# EAGLE design ReadyUNO_SMD (EAGLE 7.5.0)
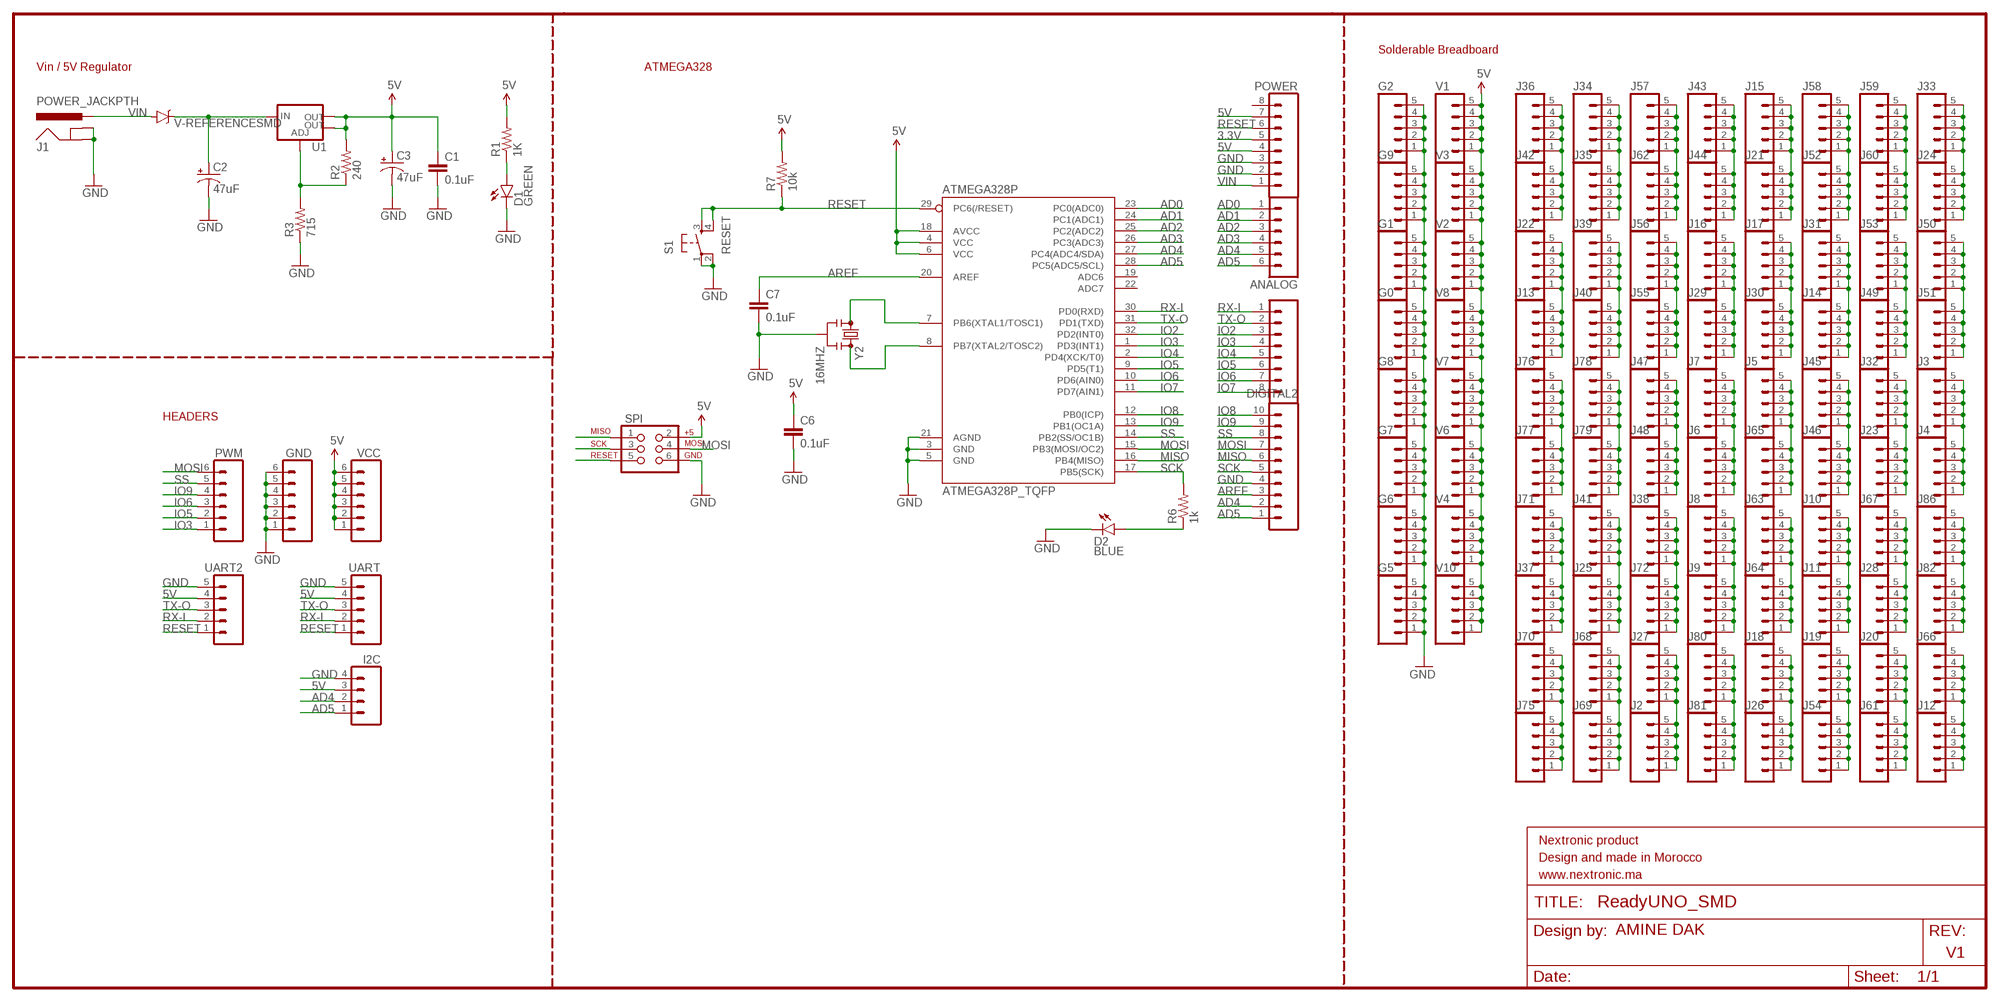
[diagram p0: schematic, sheet 1]

## Parts
ANALOG  M06SILK_FEMALE_PTH  [1X06]
ATMEGA328P  ATMEGA328P_TQFP  [TQFP32-08]
C1  0.1uF  CAP0603-CAP  [0603-CAP]
C2  47uF  CAP_POLC  [PANASONIC_C]
C3  47uF  CAP_POLC  [PANASONIC_C]
C6  0.1uF  CAP0603-CAP  [0603-CAP]
C7  0.1uF  CAP0603-CAP  [0603-CAP]
D1  GREEN  LED-GREEN1206  [LED-1206]
D2  BLUE  LED-BLUE1206  [LED-1206]
DIGITAL  M08SILK_FEMALE_PTH  [1X08]
DIGITAL2  M10SILK_FEMALE_PTH  [1X10]
FRAME1  FRAME-LETTER  [CREATIVE_COMMONS]
G0  M05PTH  [1X05]
G1  M05PTH  [1X05]
G2  M05PTH  [1X05]
G5  M05PTH  [1X05]
G6  M05PTH  [1X05]
G7  M05PTH  [1X05]
G8  M05PTH  [1X05]
G9  M05PTH  [1X05]
GND  M06SILK_FEMALE_PTH  [1X06]
I2C  M04PTH  [1X04]
J1  POWER_JACKPTH  [POWER_JACK_PTH]
J2  M05PTH  [1X05]
J3  M05PTH  [1X05]
J4  M05PTH  [1X05]
J5  M05PTH  [1X05]
J6  M05PTH  [1X05]
J7  M05PTH  [1X05]
J8  M05PTH  [1X05]
J9  M05PTH  [1X05]
J10  M05PTH  [1X05]
J11  M05PTH  [1X05]
J12  M05PTH  [1X05]
J13  M05PTH  [1X05]
J14  M05PTH  [1X05]
J15  M05PTH  [1X05]
J16  M05PTH  [1X05]
J17  M05PTH  [1X05]
J18  M05PTH  [1X05]
J19  M05PTH  [1X05]
J20  M05PTH  [1X05]
J21  M05PTH  [1X05]
J22  M05PTH  [1X05]
J23  M05PTH  [1X05]
J24  M05PTH  [1X05]
J25  M05PTH  [1X05]
J26  M05PTH  [1X05]
J27  M05PTH  [1X05]
J28  M05PTH  [1X05]
J29  M05PTH  [1X05]
J30  M05PTH  [1X05]
J31  M05PTH  [1X05]
J32  M05PTH  [1X05]
J33  M05PTH  [1X05]
J34  M05PTH  [1X05]
J35  M05PTH  [1X05]
J36  M05PTH  [1X05]
J37  M05PTH  [1X05]
J38  M05PTH  [1X05]
J39  M05PTH  [1X05]
J40  M05PTH  [1X05]
J41  M05PTH  [1X05]
J42  M05PTH  [1X05]
J43  M05PTH  [1X05]
J44  M05PTH  [1X05]
J45  M05PTH  [1X05]
J46  M05PTH  [1X05]
J47  M05PTH  [1X05]
J48  M05PTH  [1X05]
J49  M05PTH  [1X05]
J50  M05PTH  [1X05]
J51  M05PTH  [1X05]
J52  M05PTH  [1X05]
J53  M05PTH  [1X05]
J54  M05PTH  [1X05]
J55  M05PTH  [1X05]
J56  M05PTH  [1X05]
J57  M05PTH  [1X05]
J58  M05PTH  [1X05]
J59  M05PTH  [1X05]
J60  M05PTH  [1X05]
J61  M05PTH  [1X05]
J62  M05PTH  [1X05]
J63  M05PTH  [1X05]
J64  M05PTH  [1X05]
J65  M05PTH  [1X05]
J66  M05PTH  [1X05]
J67  M05PTH  [1X05]
J68  M05PTH  [1X05]
J69  M05PTH  [1X05]
J70  M05PTH  [1X05]
J71  M05PTH  [1X05]
J72  M05PTH  [1X05]
J75  M05PTH  [1X05]
J76  M05PTH  [1X05]
J77  M05PTH  [1X05]
J78  M05PTH  [1X05]
J79  M05PTH  [1X05]
J80  M05PTH  [1X05]
J81  M05PTH  [1X05]
J82  M05PTH  [1X05]
J86  M05PTH  [1X05]
POWER  M08SILK_FEMALE_PTH  [1X08]
PWM  M06SILK_FEMALE_PTH  [1X06]
R1  1K  RESISTOR0603-RES  [0603-RES]
R2  240  RESISTOR0603-RES  [0603-RES]
R3  715  RESISTOR0603-RES  [0603-RES]
R6  1k  RESISTOR0603-RES  [0603-RES]
R7  10k  RESISTOR0603-RES  [0603-RES]
S1  RESET  TAC_SWITCHSMD  [TACTILE-SWITCH-SMD]
SPI  AVR_SPI_PRG_6NS  [2X3-NS]
U1  V_REG_LM1117SOT223  [SOT223]
U$1  V-REFERENCESMD  [SOT23-3]
UART  M05PTH  [1X05]
UART2  M05PTH  [1X05]
V1  M05PTH  [1X05]
V2  M05PTH  [1X05]
V3  M05PTH  [1X05]
V4  M05PTH  [1X05]
V6  M05PTH  [1X05]
V7  M05PTH  [1X05]
V8  M05PTH  [1X05]
V10  M05PTH  [1X05]
VCC  M06SILK_FEMALE_PTH  [1X06]
Y2  16MHZ  RESONATOR16MHZ  [RESONATOR-SMD]

## Nets
3.3V: POWER.5
5V: ATMEGA328P.4(VCC) ATMEGA328P.6(VCC) ATMEGA328P.18(AVCC) C1.1 C3.+ C6.1 I2C.3 POWER.4 POWER.7 R1.2 R2.2 R7.2 SPI.2 U1.2(OUT) U1.4(OUT) UART2.4 UART.4 V1.1 V1.2 V1.3 V1.4 V1.5 V2.1 V2.2 V2.3 V2.4 V2.5 V3.1 V3.2 V3.3 V3.4 V3.5 V4.1 V4.2 V4.3 V4.4 V4.5 V6.1 V6.2 V6.3 V6.4 V6.5 V7.1 V7.2 V7.3 V7.4 V7.5 V8.1 V8.2 V8.3 V8.4 V8.5 V10.1 V10.2 V10.3 V10.4 V10.5 VCC.1 VCC.2 VCC.3 VCC.4 VCC.5 VCC.6
AD0: ANALOG.1 ATMEGA328P.23(PC0(ADC0))
AD1: ANALOG.2 ATMEGA328P.24(PC1(ADC1))
AD2: ANALOG.3 ATMEGA328P.25(PC2(ADC2))
AD3: ANALOG.4 ATMEGA328P.26(PC3(ADC3))
AD4: ANALOG.5 ATMEGA328P.27(PC4(ADC4/SDA)) DIGITAL2.2 I2C.2
AD5: ANALOG.6 ATMEGA328P.28(PC5(ADC5/SCL)) DIGITAL2.1 I2C.1
AREF: ATMEGA328P.20(AREF) C7.1 DIGITAL2.3
GND: ATMEGA328P.3(GND) ATMEGA328P.5(GND) ATMEGA328P.21(AGND) C1.2 C2.- C3.- C6.2 C7.2 D1.C D2.C DIGITAL2.4 G0.1 G0.2 G0.3 G0.4 G0.5 G1.1 G1.2 G1.3 G1.4 G1.5 G2.1 G2.2 G2.3 G2.4 G2.5 G5.1 G5.2 G5.3 G5.4 G5.5 G6.1 G6.2 G6.3 G6.4 G6.5 G7.1 G7.2 G7.3 G7.4 G7.5 G8.1 G8.2 G8.3 G8.4 G8.5 G9.1 G9.2 G9.3 G9.4 G9.5 GND.1 GND.2 GND.3 GND.4 GND.5 GND.6 I2C.4 J1.GND J1.GNDBREAK POWER.2 POWER.3 R3.1 S1.1 S1.2 SPI.6 UART2.5 UART.5 Y2.2
IO2: ATMEGA328P.32(PD2(INT0)) DIGITAL.3
IO3: ATMEGA328P.1(PD3(INT1)) DIGITAL.4 PWM.1
IO4: ATMEGA328P.2(PD4(XCK/T0)) DIGITAL.5
IO5: ATMEGA328P.9(PD5(T1)) DIGITAL.6 PWM.2
IO6: ATMEGA328P.10(PD6(AIN0)) DIGITAL.7 PWM.3
IO7: ATMEGA328P.11(PD7(AIN1)) DIGITAL.8
IO8: ATMEGA328P.12(PB0(ICP)) DIGITAL2.10
IO9: ATMEGA328P.13(PB1(OC1A)) DIGITAL2.9 PWM.4
MISO: ATMEGA328P.16(PB4(MISO)) DIGITAL2.6 SPI.1
MOSI: ATMEGA328P.15(PB3(MOSI/OC2)) DIGITAL2.7 PWM.6 SPI.4
N$1: R2.1 R3.2 U1.1(ADJ)
N$2: D2.A R6.1
N$3: C2.+ U1.3(IN) U$1.1(C)
N$4: D1.A R1.1
N$6: J37.1 J37.2 J37.3 J37.4 J37.5 J71.1 J71.2 J71.3 J71.4 J71.5
N$7: ATMEGA328P.7(PB6(XTAL1/TOSC1)) Y2.1
N$8: ATMEGA328P.8(PB7(XTAL2/TOSC2)) Y2.3
N$9: J3.1 J3.2 J3.3 J3.4 J3.5 J4.1 J4.2 J4.3 J4.4 J4.5
N$11: J10.1 J10.2 J10.3 J10.4 J10.5 J11.1 J11.2 J11.3 J11.4 J11.5
N$12: J76.1 J76.2 J76.3 J76.4 J76.5 J77.1 J77.2 J77.3 J77.4 J77.5
N$13: J28.1 J28.2 J28.3 J28.4 J28.5 J67.1 J67.2 J67.3 J67.4 J67.5
N$14: J25.1 J25.2 J25.3 J25.4 J25.5 J41.1 J41.2 J41.3 J41.4 J41.5
N$15: J78.1 J78.2 J78.3 J78.4 J78.5 J79.1 J79.2 J79.3 J79.4 J79.5
N$16: J82.1 J82.2 J82.3 J82.4 J82.5 J86.1 J86.2 J86.3 J86.4 J86.5
N$17: J45.1 J45.2 J45.3 J45.4 J45.5 J46.1 J46.2 J46.3 J46.4 J46.5
N$19: J47.1 J47.2 J47.3 J47.4 J47.5 J48.1 J48.2 J48.3 J48.4 J48.5
N$20: J12.1 J12.2 J12.3 J12.4 J12.5 J66.1 J66.2 J66.3 J66.4 J66.5
N$21: J20.1 J20.2 J20.3 J20.4 J20.5 J61.1 J61.2 J61.3 J61.4 J61.5
N$23: J38.1 J38.2 J38.3 J38.4 J38.5 J72.1 J72.2 J72.3 J72.4 J72.5
N$24: J24.1 J24.2 J24.3 J24.4 J24.5 J33.1 J33.2 J33.3 J33.4 J33.5
N$25: J23.1 J23.2 J23.3 J23.4 J23.5 J32.1 J32.2 J32.3 J32.4 J32.5
N$27: J49.1 J49.2 J49.3 J49.4 J49.5 J53.1 J53.2 J53.3 J53.4 J53.5
N$28: J59.1 J59.2 J59.3 J59.4 J59.5 J60.1 J60.2 J60.3 J60.4 J60.5
N$29: J14.1 J14.2 J14.3 J14.4 J14.5 J31.1 J31.2 J31.3 J31.4 J31.5
N$30: J17.1 J17.2 J17.3 J17.4 J17.5 J30.1 J30.2 J30.3 J30.4 J30.5
N$31: J52.1 J52.2 J52.3 J52.4 J52.5 J58.1 J58.2 J58.3 J58.4 J58.5
N$32: J50.1 J50.2 J50.3 J50.4 J50.5 J51.1 J51.2 J51.3 J51.4 J51.5
N$33: J16.1 J16.2 J16.3 J16.4 J16.5 J29.1 J29.2 J29.3 J29.4 J29.5
N$34: J43.1 J43.2 J43.3 J43.4 J43.5 J44.1 J44.2 J44.3 J44.4 J44.5
N$35: J15.1 J15.2 J15.3 J15.4 J15.5 J21.1 J21.2 J21.3 J21.4 J21.5
N$36: J36.1 J36.2 J36.3 J36.4 J36.5 J42.1 J42.2 J42.3 J42.4 J42.5
N$37: J13.1 J13.2 J13.3 J13.4 J13.5 J22.1 J22.2 J22.3 J22.4 J22.5
N$38: J6.1 J6.2 J6.3 J6.4 J6.5 J7.1 J7.2 J7.3 J7.4 J7.5
N$39: J8.1 J8.2 J8.3 J8.4 J8.5 J9.1 J9.2 J9.3 J9.4 J9.5
N$40: J34.1 J34.2 J34.3 J34.4 J34.5 J35.1 J35.2 J35.3 J35.4 J35.5
N$41: J39.1 J39.2 J39.3 J39.4 J39.5 J40.1 J40.2 J40.3 J40.4 J40.5
N$42: J5.1 J5.2 J5.3 J5.4 J5.5 J65.1 J65.2 J65.3 J65.4 J65.5
N$43: J63.1 J63.2 J63.3 J63.4 J63.5 J64.1 J64.2 J64.3 J64.4 J64.5
N$44: J57.1 J57.2 J57.3 J57.4 J57.5 J62.1 J62.2 J62.3 J62.4 J62.5
N$45: J55.1 J55.2 J55.3 J55.4 J55.5 J56.1 J56.2 J56.3 J56.4 J56.5
N$46: J19.1 J19.2 J19.3 J19.4 J19.5 J54.1 J54.2 J54.3 J54.4 J54.5
N$47: J80.1 J80.2 J80.3 J80.4 J80.5 J81.1 J81.2 J81.3 J81.4 J81.5
N$48: J18.1 J18.2 J18.3 J18.4 J18.5 J26.1 J26.2 J26.3 J26.4 J26.5
N$49: J70.1 J70.2 J70.3 J70.4 J70.5 J75.1 J75.2 J75.3 J75.4 J75.5
N$50: J2.1 J2.2 J2.3 J2.4 J2.5 J27.1 J27.2 J27.3 J27.4 J27.5
N$51: J68.1 J68.2 J68.3 J68.4 J68.5 J69.1 J69.2 J69.3 J69.4 J69.5
RESET: ATMEGA328P.29(PC6(/RESET)) POWER.6 R7.1 S1.3 S1.4 SPI.5 UART2.1 UART.1
RX-I: ATMEGA328P.30(PD0(RXD)) DIGITAL.1 UART2.2 UART.2
SCK: ATMEGA328P.17(PB5(SCK)) DIGITAL2.5 R6.2 SPI.3
SS: ATMEGA328P.14(PB2(SS/OC1B)) DIGITAL2.8 PWM.5
TX-O: ATMEGA328P.31(PD1(TXD)) DIGITAL.2 UART2.3 UART.3
VIN: J1.PWR POWER.1 U$1.2(A)
Unconnected: ATMEGA328P.19(ADC6) ATMEGA328P.22(ADC7) POWER.8

## Notes on the sheet
- Solderable Breadboard
- Vin / 5V Regulator | ATMEGA328
- HEADERS
- AMINE DAK
- V1

## Library data of the parts
ANALOG GND PWM VCC = SparkFun-Connectors:M06: Header 6 Standard 6-pin 0.1" header. Use with straight break away headers (SKU : PRT-00116), right angle break away headers (PRT-00553), swiss pins (PRT-00743), machine pins (PRT-00117), and female headers (PRT-00115). Molex polarized connector foot print use with SKU : PRT-08094 with associated crimp pins and housings. NOTES ON THE VARIANTS LOCK and LOCK_LONGPADS... This footprint was designed to help hold the alignment of a through-hole component (i.e. 6-pin header) while soldering it into place. You may notice that each hole has been shifted either up or down by 0.005 of an inch from it's more standard position (which is a perfectly straight line). This slight alteration caused the pins (the squares in the middle) to touch the edges of the holes. Because they are alternating, it causes a "brace" to hold the component in place. 0.005 has proven to be the perfect amount of "off-center" position when using our standard breakaway headers. Although looks a little odd when you look at the bare footprint, once you have a header in there, the alteration is very hard to notice. Also,if you push a header all the way into place, it is covered up entirely on the bottom side. This idea of altering the position of holes to aid alignment will be further integrated into the Sparkfun Library for other footprints. It can help hold any component with 3 or more connection pins.; OC_FARNELL: unknown; PROD_ID: CONN-08437
ATMEGA328P = SparkFun-DigitalIC:ATMEGA328P_TQFP; OC_FARNELL: unknown; PROD_ID: IC-09069
C1 C6 C7 = SparkFun-Passives:CAP: Capacitor Standard 0603 ceramic capacitor, and 0.1" leaded capacitor.; OC_FARNELL: unknown
C2 C3 = SparkFun-Capacitors:CAP_POL: Capacitor Polarized These are standard SMD and PTH capacitors. Normally 10uF, 47uF, and 100uF in electrolytic and tantalum varieties. Always verify the external diameter of the through hole cap, it varies with capacity, voltage, and manufacturer. The EIA devices should be standard.; OC_FARNELL: unknown
D1 = SparkFun-LED:LED-GREEN: Various green LEDs Green LEDs used in SFE Production 0603- DIO-00821 LARGE- DIO-00862 LILYPAD- DIO-09910; OC_FARNELL: unknown; PROD_ID: DIO-00862
D2 = SparkFun-LED:LED-BLUE: Blue LEDs for production use Various blue LEDs stocked by SparkFun production 0603 - DIO-08575 Rebel - DIO-09553 1206 - DIO-09911; OC_FARNELL: unknown; PROD_ID: DIO-09911
DIGITAL POWER = SparkFun-Connectors:M08: Header 8 Standard 8-pin 0.1" header. Use with straight break away headers (SKU : PRT-00116), right angle break away headers (PRT-00553), swiss pins (PRT-00743), machine pins (PRT-00117), and female headers (PRT-00115).; OC_FARNELL: unknown; PROD_ID: CONN-08438
DIGITAL2 = SparkFun-Connectors:M10: Header 10 Standard 10-pin 0.1" header. Use with straight break away headers (SKU : PRT-00116), right angle break away headers (PRT-00553), swiss pins (PRT-00743), machine pins (PRT-00117), and female headers (PRT-00115).; OC_FARNELL: unknown; PROD_ID: CONN-11563
FRAME1 = SparkFun-Aesthetics:FRAME-LETTER: Schematic Frame Standard 8.5x11 US Letter frame; OC_FARNELL: unknown
G0 G1 G2 G5-G9 J2-J72 J75-J82 J86 UART UART2 V1-V4 V6-V8 V10 = SparkFun-Connectors:M05: Header 5 Standard 5-pin 0.1" header. Use with straight break away headers (SKU : PRT-00116), right angle break away headers (PRT-00553), swiss pins (PRT-00743), machine pins (PRT-00117), and female headers (PRT-00115). Molex polarized connector foot print use with SKU : PRT-08230 with associated crimp pins and housings.; OC_FARNELL: unknown
I2C = SparkFun-Connectors:M04: Header 4 Standard 4-pin 0.1" header. Use with straight break away headers (SKU : PRT-00116), right angle break away headers (PRT-00553), swiss pins (PRT-00743), machine pins (PRT-00117), and female headers (PRT-00115). Molex polarized connector foot print use with SKU : PRT-08231 with associated crimp pins and housings. 1MM SMD Version SKU: PRT-10208; OC_FARNELL: unknown; PROD_ID: CONN-09696
J1 = SparkFun-Connectors:POWER_JACK: Power Jack This is the standard 5.5mm barrel jack for power. The PTH is the most common, proven, reliable, footprint. The Slot footprint only works if the mill layer is transmitted to the PCB fab house so be warned. Mating wall wart : TOL-00298 (and others); OC_FARNELL: unknown; PROD_ID: CONN-08197
R1-R3 R6 R7 = SparkFun-Passives:RESISTOR: Resistor Basic schematic elements and footprints for 0603, 1206, and PTH resistors.; OC_FARNELL: unknown
S1 = SparkFun-Retired:TAC_SWITCH: Momentary Switch Button commonly used for reset or general input. Spark Fun Electronics SKU : COM-00097 SMT- SWCH-08247; OC_FARNELL: unknown; PROD_ID: SWCH-08247; VALUE: TAC_SWITCHSMD
SPI = SparkFun-Connectors:AVR_SPI_PRG_6: AVR ISP 6 Pin This is the reduced ISP connector for AVR programming. Common on Arduino. This footprint will take up less PCB space and can be used with a 10-pin to 6-pin adapter such as SKU: BOB-08508 **Special note about "TEST_POINT" package. The stop mask is on the top side, so if you want your programming test points to be on the bottom of your board, make sure to place this package on the bottom side of the board. This also ensure that the orientation to program from the bottom side will be correct.; OC_FARNELL: unknown
U1 = SparkFun-PowerIC:V_REG_LM1117: Voltage Regulator LM1117 Standard adjustable voltage regulator but in SMD form. Spark Fun Electronics SKU : COM-00595; OC_FARNELL: unknown; PROD_ID: VREG-08170
U$1 = SparkFun-DiscreteSemi:V-REFERENCE: Zener diode; OC_FARNELL: unknown
Y2 = SparkFun-FreqCtrl:RESONATOR: Resonator Small SMD resonator. Used, eg, on the Arduino Pro/ Pro Mini boards. 8MHz- XTAL-08895 16MHz- XTAL-08900; OC_FARNELL: unknown; PROD_ID: XTAL-08900

## Board
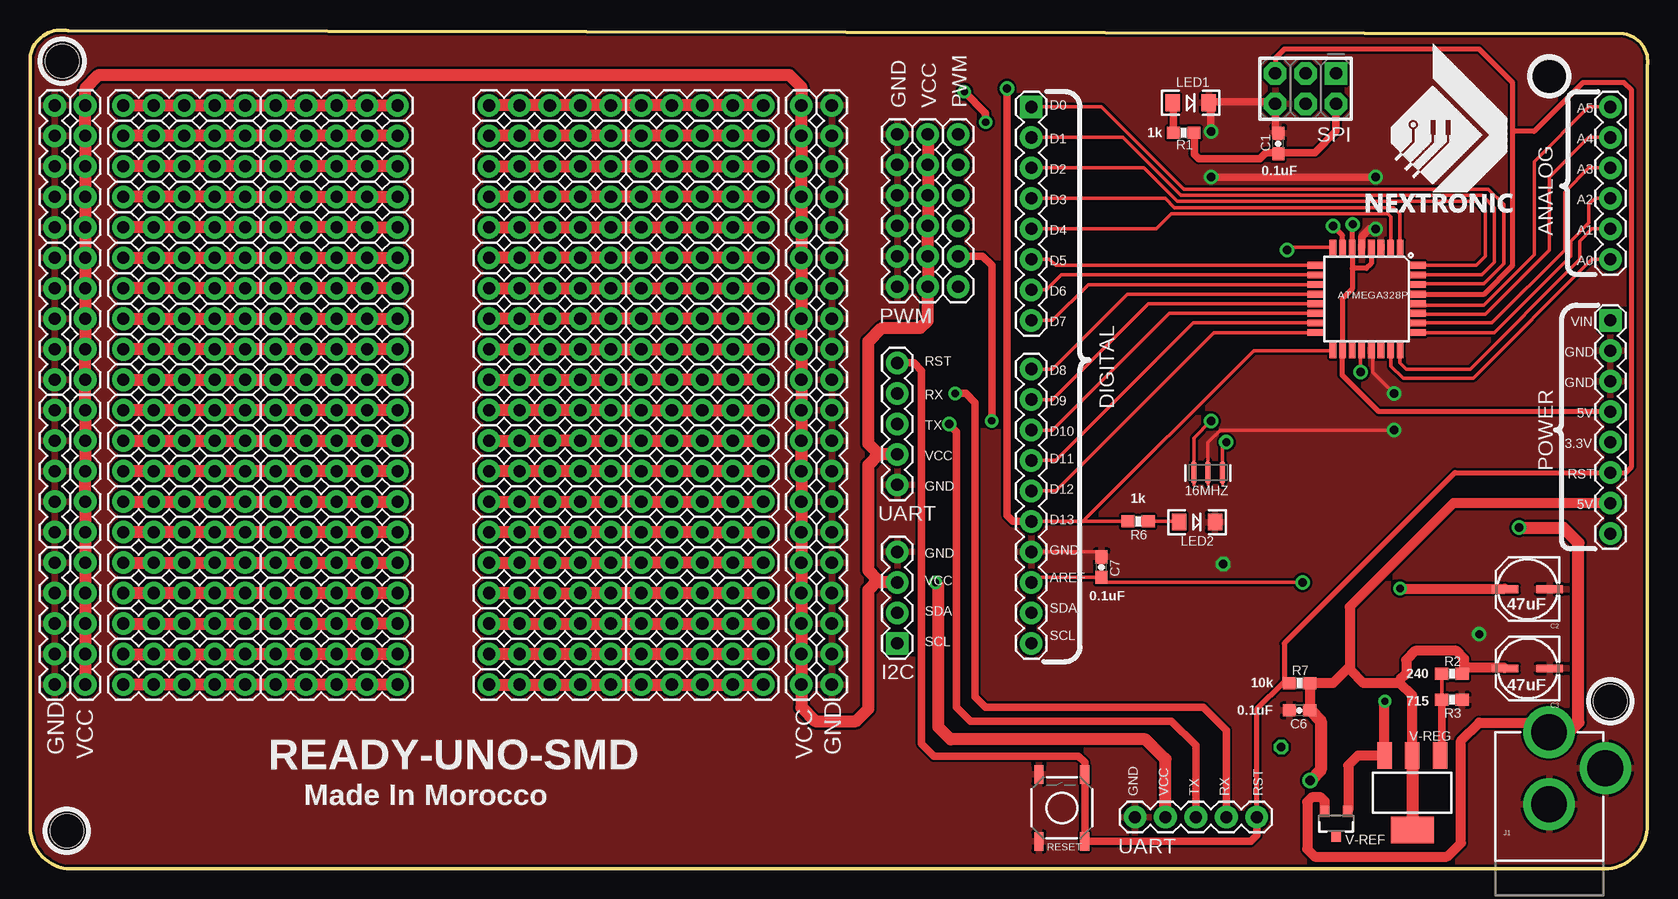
[diagram p1: board, top side]
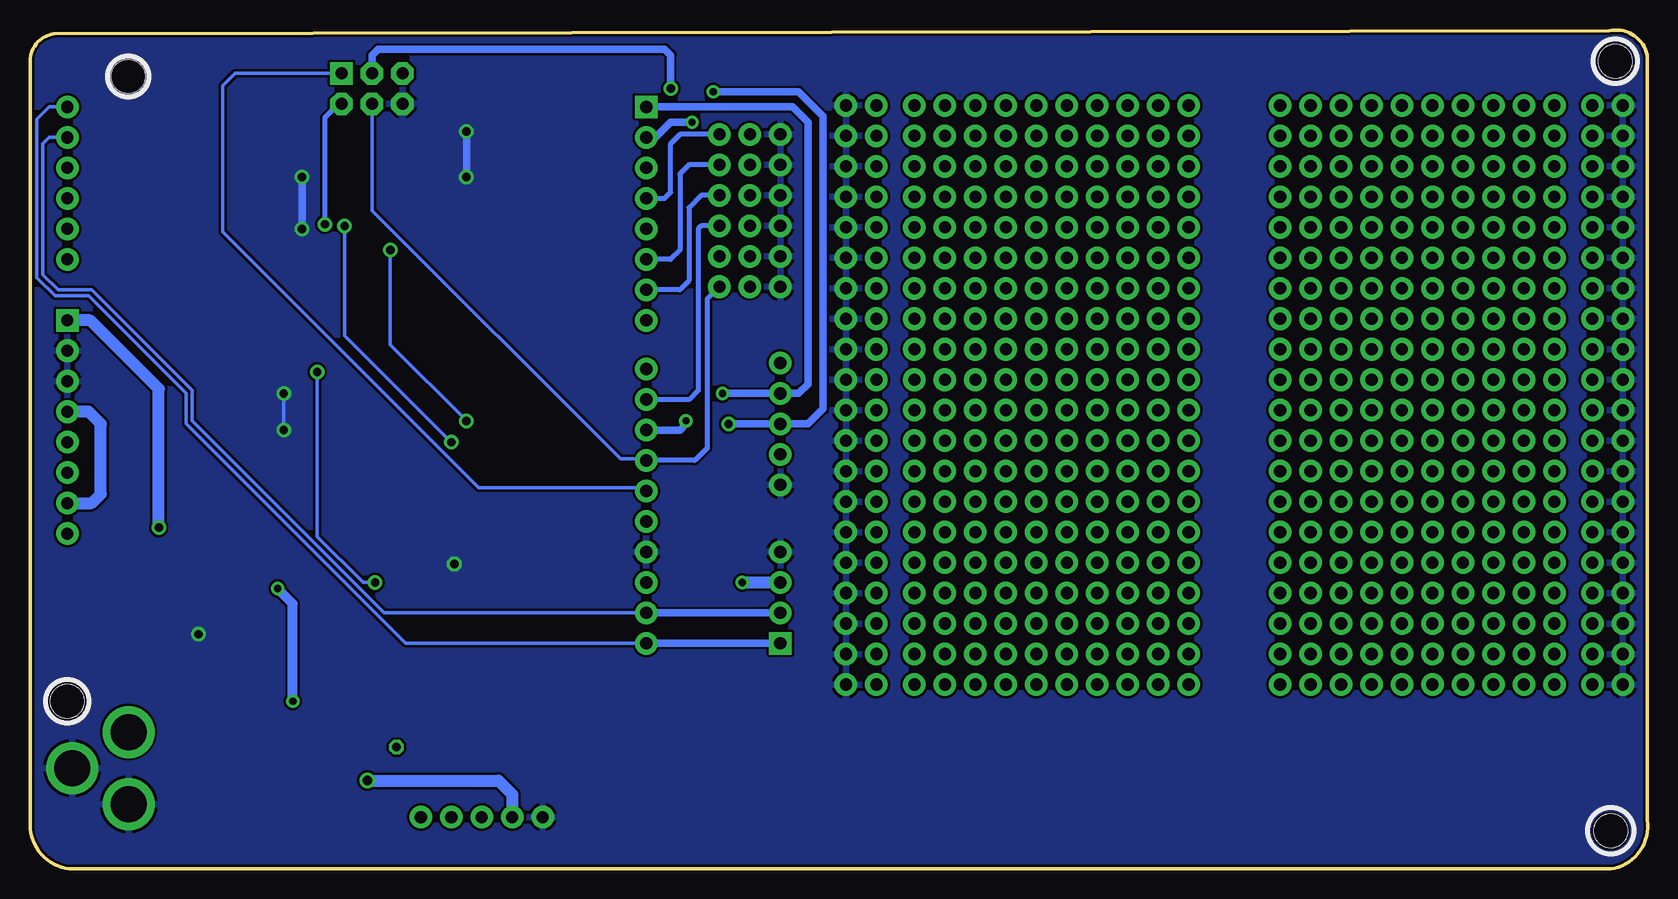
[diagram p2: board, bottom side, seen from below]

Size 134.85 x 69.91 mm. Coordinates in mm from the lower left corner, seen from the top.
Outline: 134.82,3.68 134.82,66.93 arc90 132.87,69.6 3.21,69.85 arc90 0.03,67.82 0.03,4.06 arc90 3.08,0 131.22,0 arc90 134.82,3.68
Copper layers (1*16): Top 0.035mm / dielectric 1.5mm / Bottom 0.035mm
Design rules "SparkFun": minimum track width 8mil, minimum drill 20mil, track to track 8mil, track to pad 8mil, pad to pad 8mil, via to via 8mil, smd to smd 8mil, copper to edge 8mil, drill to drill 8mil, minimum pad ring 12mil, minimum via ring 10mil, stop-mask expansion 4mil, vias tented up to drill 20mil, thermal gap 10mil
Holes 2.8 mm at 2.7,67.31 3.08,3.18 131.73,13.97 126.65,66.04

### Footprints (pad centres in the part's own frame; a part is rotated, then mirrored left to right if it is on the bottom)
1X06 = drill 1.016 pad 1.88: 1 0,0; 2 2.54,0; 3 5.08,0; 4 7.62,0; 5 10.16,0; 6 12.7,0
TQFP32-08 = smd 1.27 x 0.559: 1 -4.293,2.8; 2 -4.293,2; 3 -4.293,1.2; 4 -4.293,0.4; 5 -4.293,-0.4; 6 -4.293,-1.2; 7 -4.293,-2; 8 -4.293,-2.8; 17 4.293,-2.8; 18 4.293,-2; 19 4.293,-1.2; 20 4.293,-0.4; 21 4.293,0.4; 22 4.293,1.2; 23 4.293,2; 24 4.293,2.8 | smd 0.559 x 1.27: 9 -2.8,-4.293; 10 -2,-4.293; 11 -1.2,-4.293; 12 -0.4,-4.293; 13 0.4,-4.293; 14 1.2,-4.293; 15 2,-4.293; 16 2.8,-4.293; 25 2.8,4.293; 26 2,4.293; 27 1.2,4.293; 28 0.4,4.293; 29 -0.4,4.293; 30 -1.2,4.293; 31 -2,4.293; 32 -2.8,4.293
0603-CAP = smd 1.1 x 1: 1 -0.85,0; 2 0.85,0
PANASONIC_C = smd 2.2 x 0.65: + 1.9,-0.2; - -1.8,-0.2
LED-1206 = smd 1.2 x 1.4: A -1.5,0; C 1.5,0
1X08 = drill 1.016 pad 1.88 square: 1 0,0 | drill 1.016 pad 1.88: 2 2.54,0; 3 5.08,0; 4 7.62,0; 5 10.16,0; 6 12.7,0; 7 15.24,0; 8 17.78,0
1X10 = drill 1.016 pad 1.88: 1 0,0; 2 2.54,0; 3 5.08,0; 4 7.62,0; 5 10.16,0; 6 12.7,0; 7 15.24,0; 8 17.78,0; 9 20.32,0; 10 22.86,0
1X05 = drill 1.016 pad 1.88: 1 0,0; 2 2.54,0; 3 5.08,0; 4 7.62,0; 5 10.16,0
1X04 = drill 1.016 pad 1.88 square: 1 0,0 | drill 1.016 pad 1.88: 2 2.54,0; 3 5.08,0; 4 7.62,0
POWER_JACK_PTH = drill 2.997 pad 4.318: GND 0,7.7; GNDBREAK 4.7,10.7; PWR 0,13.7
0603-RES = smd 1.1 x 1: 1 -0.85,0; 2 0.85,0
TACTILE-SWITCH-SMD = smd 1.524 x 0.762: 1 -2.794,1.905; 2 2.794,1.905; 3 -2.794,-1.905; 4 2.794,-1.905
2X3-NS = drill 1.016 pad 1.88 square: 1 -2.54,-1.27 | drill 1.016 pad 1.88 octagon: 2 -2.54,1.27; 3 0,-1.27; 4 0,1.27; 5 2.54,-1.27; 6 2.54,1.27
SOT223 = smd 1.219 x 2.235: 1 -2.311,-3.099; 2 0,-3.099; 3 2.311,-3.099 | smd 3.6 x 2.2: 4 0,3.099
SOT23-3 = smd 0.8 x 0.9: 1 -0.95,-1; 2 0.95,-1; 3 0,1.1
RESONATOR-SMD = smd 0.45 x 1.905: 1 -1.2,0; 2 0,0; 3 1.2,0

### Placement (x,y rotation side)
ANALOG  131.73,50.8 90 top
ATMEGA328P  111.41,47.5 270 top
C1  104.05,60.45 90 top
C2  124.87,23.11 180 top
C3  124.87,16.51 180 top
C6  105.82,13.21 180 top
C7  89.31,25.15 90 top
D1  96.75,63.84 0 top
D2  97.28,28.91 0 top
DIGITAL  83.47,63.5 270 top
DIGITAL2  83.47,18.8 90 top
FRAME1  20.61,-10.79 0 top  (outside the outline)
G0  66.83,40.77 90 top
G1  66.83,53.47 90 top
G2  2.06,25.53 270 top
G5  2.06,63.63 270 top
G6  2.06,40.77 90 top
G7  2.06,28.07 90 top
G8  66.83,28.07 90 top
G9  66.83,25.53 270 top
GND  72.3,61.21 270 top
I2C  72.3,18.8 90 top
J1  126.63,-2.3 0 top
J2  30.64,22.99 180 top
J3  38.26,58.55 0 top
J4  50.96,58.55 0 top
J5  20.48,56.01 0 top
J6  50.96,61.09 0 top
J7  38.26,61.09 0 top
J8  50.96,30.61 0 top
J9  38.26,30.61 0 top
J10  50.96,63.63 0 top
J11  38.26,63.63 0 top
J12  38.26,20.45 0 top
J13  17.94,63.63 180 top
J14  50.96,33.15 0 top
J15  20.48,33.15 0 top
J16  20.48,35.69 0 top
J17  20.48,30.61 0 top
J18  38.26,25.53 0 top
J19  50.96,22.99 0 top
J20  20.48,25.53 0 top
J21  7.78,33.15 0 top
J22  20.48,63.63 0 top
J23  61.12,40.77 180 top
J24  61.12,38.23 180 top
J25  20.48,40.77 0 top
J26  61.12,25.53 180 top
J27  7.78,22.99 0 top
J28  20.48,20.45 0 top
J29  7.78,35.69 0 top
J30  7.78,30.61 0 top
J31  38.26,33.15 0 top
J32  38.26,40.77 0 top
J33  38.26,38.23 0 top
J34  20.48,38.23 0 top
J35  7.78,38.23 0 top
J36  48.42,45.85 180 top
J37  38.26,56.01 0 top
J38  20.48,43.31 0 top
J39  50.96,43.31 0 top
J40  38.26,43.31 0 top
J41  7.78,40.77 0 top
J42  50.96,45.85 0 top
J43  38.26,48.39 0 top
J44  50.96,48.39 0 top
J45  20.48,45.85 0 top
J46  7.78,45.85 0 top
J47  20.48,28.07 0 top
J48  7.78,28.07 0 top
J49  7.78,48.39 0 top
J50  50.96,50.93 0 top
J51  38.26,50.93 0 top
J52  30.64,53.47 180 top
J53  20.48,48.39 0 top
J54  38.26,22.99 0 top
J55  38.26,53.47 0 top
J56  50.96,53.47 0 top
J57  7.78,50.93 0 top
J58  7.78,53.47 0 top
J59  50.96,28.07 0 top
J60  38.26,28.07 0 top
J61  7.78,25.53 0 top
J62  20.48,50.93 0 top
J63  20.48,58.55 0 top
J64  7.78,58.55 0 top
J65  7.78,56.01 0 top
J66  61.12,20.45 180 top
J67  7.78,20.45 0 top
J68  7.78,17.91 0 top
J69  20.48,17.91 0 top
J70  50.96,17.91 0 top
J71  50.96,56.01 0 top
J72  7.78,43.31 0 top
J75  48.42,17.91 180 top
J76  20.48,61.09 0 top
J77  7.78,61.09 0 top
J78  50.96,35.69 0 top
J79  38.26,35.69 0 top
J80  38.26,15.37 0 top
J81  50.96,15.37 0 top
J82  7.78,15.37 0 top
J86  20.48,15.37 0 top
POWER  131.73,45.72 270 top
PWM  77.38,61.21 270 top
R1  96.17,61.34 0 top
R2  118.52,16.26 0 top
R3  118.52,14.1 180 top
R6  92.36,28.96 180 top
R7  105.82,15.49 0 top
S1  86.01,5.08 90 top
SPI  106.33,65.02 180 top
U1  115.22,6.35 180 top
U$1  108.87,3.81 180 top
UART  72.3,42.16 270 top
UART2  102.27,4.32 180 top
V1  4.6,50.93 270 top
V2  4.6,28.07 90 top
V3  64.29,53.47 90 top
V4  4.6,25.53 270 top
V6  64.29,38.23 270 top
V7  64.29,50.93 270 top
V8  4.6,53.47 90 top
V10  64.29,25.53 270 top
VCC  74.84,61.21 270 top
Y2  98.2,33.02 180 top

### Tracks (layer width: path | path; a pad name or v marks a point on that pad's centre or on a via)
5V  (via drill 0.6, 0.7, 0.8)
  Top 0.305: 109.38,43.24 ATMEGA328P.18 109.38,43.17 | 122.92,16.76 C3.+ | 104.23,59.69 C1.1 | 119.88,16.76 R2.2 119.54,16.42
  Top 0.406: 110.21,50.04 ATMEGA328P.6 110.21,53.66 v110.27,53.72 | 110.21,50.04 110.21,48.33 109.38,47.5 109.38,43.24 | ATMEGA328P.4 111.81,50.44 111.41,50.04 110.21,50.04 | POWER.4 112.43,38.1 109.38,41.15 109.38,43.17 | 103.86,59.69 C1.1
  Top 0.61: SPI.2 108.87,61.47 107.09,59.69 104.23,59.69 | 103.86,59.69 103.03,59.69 102.52,59.18 97.44,59.18 97.06,59.56 97.06,61.3 R1.2
  Top 0.813: C6.1 R7.2 108.62,15.49 110.01,16.89 | 122.92,16.76 119.88,16.76 | 119.54,16.42 119.54,17.53 118.9,18.16 115.48,18.16 114.71,17.4 114.71,16.26 114.21,15.75 114.21,15.49 | POWER.7 118.65,30.48 110.01,21.84 110.01,16.89 | 110.01,16.89 110.01,16.64 111.16,15.49 114.21,15.49 | U1.2 115.22,14.48 114.21,15.49
  Top 1.016: U1.2 U1.4 | VCC.1 VCC.2 VCC.3 VCC.4 VCC.5 VCC.6 74.84,45.72 74.2,45.09 71.03,45.09 69.88,43.94 69.88,35.43 70.77,34.54 | v75.47,23.88 75.72,23.62 75.72,11.81 76.74,10.8 93,10.8 94.65,9.14 UART2.4 | UART.4 70.77,34.54 | I2C.3 70.9,23.88 70.71,24.07 | 70.71,24.07 69.88,24.89 69.88,33.66 70.77,34.54 | C6.1 106.71,13.21 107.6,12.32 107.6,8.25 v106.71,7.37 | V6.2 V6.1 V7.5 V7.4 V7.3 V7.2 V7.1 V3.1 V3.2 V3.3 V3.4 V3.5 64.29,65.15 63.28,66.17 5.75,66.17 4.6,65.02 V8.5 V8.4 V8.3 V8.2 V8.1 V1.1 V1.2 V1.3 V1.4 V1.5 V2.5 V2.4 V2.3 V2.2 V2.1 V4.1 V4.2 V4.3 V4.4 V4.5 | V6.2 V6.3 V6.4 V6.5 V10.1 V10.2 V10.3 V10.4 V10.5 | V6.2 64.29,13.46 65.44,12.32 68.87,12.32 69.88,13.34 69.88,23.24 70.71,24.07
  Bottom 0.406: SPI.2 109.13,63.75 110.27,62.61 v110.27,53.72
  Bottom 1.016: POWER.7 129.7,30.48 128.94,31.24 128.94,37.08 129.95,38.1 POWER.4 | v75.47,23.88 I2C.3 | v106.71,7.37 95.79,7.37 94.65,6.22 UART2.4
AD0
  Top 0.305: ANALOG.1 130.21,50.8 120.3,40.89 114.46,40.89 113.44,41.91 113.44,43.17 ATMEGA328P.23
AD1
  Top 0.305: ANALOG.2 130.21,53.34 129.19,52.32 129.19,50.8 120.05,41.66 114.71,41.66 114.21,42.16 ATMEGA328P.24
AD2
  Top 0.305: ATMEGA328P.25 122.07,44.7 128.43,51.05 128.43,52.32 129.95,53.85 129.95,55.37 130.46,55.88 ANALOG.3
AD3
  Top 0.305: ATMEGA328P.26 121.86,45.5 127.92,51.56 127.92,56.39 129.95,58.42 ANALOG.4
AD4
  Top 0.305: ANALOG.5 129.95,60.96 126.65,57.66 126.65,51.56 121.32,46.23 115.77,46.23 ATMEGA328P.27
  Bottom 0.305: DIGITAL2.2 105.32,21.34 121.32,37.34 121.32,39.88 129.7,48.26 132.49,48.26 133.76,49.53 133.76,60.45 133.26,60.96 ANALOG.5
  Bottom 0.61: DIGITAL2.2 I2C.2
AD5
  Top 0.305: ANALOG.6 129.95,63.5 125.38,58.93 125.38,51.18 121.19,46.99 115.81,46.99 ATMEGA328P.28 115.85,47.24
  Bottom 0.305: DIGITAL2.1 103.54,18.8 121.83,37.08 121.83,39.62 129.95,47.75 132.75,47.75 134.27,49.28 134.27,62.48 133.26,63.5 ANALOG.6
  Bottom 0.61: I2C.1 DIGITAL2.1
AREF  (via drill 0.7)
  Top 0.305: ATMEGA328P.20 110.9,43.2 v110.9,41.4 | v106.08,23.88 89.73,23.88 C7.1 83.89,24.3 DIGITAL2.3
  Bottom 0.305: v110.9,41.4 110.9,27.69 107.09,23.88 v106.08,23.88
GND  (via drill 0.7)
  Top 0.305: DIGITAL2.4 89.18,26.42 C7.2 | 98.2,34.04 98.2,35.56 99.22,36.58 v113.7,36.58 | 103.79,61.29 C1.2 | ATMEGA328P.21 111.92,43.1 111.92,41.4 v113.7,39.62 | 98.35,63.94 D1.C 98.46,63.63
  Top 0.61: 103.79,61.29 SPI.6 103.61,63.94 98.35,63.94 | ATMEGA328P.5 111.01,52.69 111.67,53.34 v112.17,53.34 | v112.17,57.66 v98.46,57.66 | v98.46,61.47 98.46,63.63
  Bottom 0.305: v113.7,36.58 v113.7,39.62
  Bottom 0.61: v98.46,57.66 v98.46,61.47 | v112.17,53.34 v112.17,57.66
  other vias: 99.47,25.4 120.81,19.56
  pour Top: 0.03,69.72 0.03,0.38 134.88,0.55 134.88,69.89
  pour Bottom: -0.09,69.47 -0.09,0.13 134.68,0.39 134.93,69.74
IO2
  Top 0.305: DIGITAL.3 92.87,58.42 95.66,55.63 120.56,55.63 121.32,54.86 121.32,51.05 120.56,50.29 ATMEGA328P.32
IO3
  Top 0.305: DIGITAL.4 94.65,55.88 95.41,55.12 113.7,55.12 114.21,54.61 ATMEGA328P.1
  Bottom 0.406: PWM.1 80.68,61.21 81.44,60.45 81.44,56.39 81.95,55.88 DIGITAL.4
IO4
  Top 0.305: DIGITAL.5 93.89,53.34 95.16,54.61 113.19,54.61 113.44,54.36 113.44,51.82 ATMEGA328P.2
IO5
  Top 0.305: DIGITAL.6 85,50.8 85.5,50.29 ATMEGA328P.9
  Bottom 0.406: PWM.2 79.92,58.67 80.68,57.91 80.68,51.56 81.44,50.8 DIGITAL.6
IO6
  Top 0.305: DIGITAL.7 84.74,48.26 85.98,49.5 ATMEGA328P.10
  Bottom 0.406: PWM.3 78.9,56.13 79.92,55.12 79.92,49.02 80.68,48.26 DIGITAL.7
IO7
  Top 0.305: ATMEGA328P.11 88.23,48.7 85.25,45.72 DIGITAL.8
IO8
  Top 0.305: ATMEGA328P.12 91.49,47.9 85.25,41.66 DIGITAL2.10
IO9
  Top 0.305: ATMEGA328P.13 93.23,47.1 85.25,39.12 DIGITAL2.9
  Bottom 0.406: PWM.4 78.9,53.59 79.15,53.34 79.15,39.88 79.92,39.12 DIGITAL2.9
MISO
  Top 0.305: ATMEGA328P.16 98.71,44.7 85.5,31.5 DIGITAL2.6
  Bottom 0.305: SPI.1 117.76,66.29 118.78,65.28 118.78,53.09 97.44,31.75 83.73,31.75 DIGITAL2.6
MOSI
  Top 0.305: ATMEGA328P.15 96.97,45.5 85.5,34.04 DIGITAL2.7
  Bottom 0.305: SPI.4 106.33,54.86 85.63,34.16 83.6,34.16
  Bottom 0.406: 83.6,34.16 DIGITAL2.7 79.41,34.04 78.39,35.05 78.39,47.5 PWM.6
N$1
  Top 0.305: R2.1 R3.2 | 117.67,9.59 U1.1
  Top 0.61: R3.2 117.67,9.59
N$2
  Top 0.305: R6.1 93.25,28.99 95.7,28.99 D2.A
N$3  (via drill 0.6)
  Top 0.305: 109.89,4.88 U$1.1 | 122.92,23.37 C2.+ | 112.91,13.95 v112.94,13.97
  Top 0.813: 109.89,4.88 109.89,8.64 110.7,9.45 U1.3 112.91,13.95 | v114.21,23.37 122.92,23.37
  Bottom 0.813: v112.94,13.97 112.94,22.1 v114.21,23.37
N$4
  Top 0.305: 95.32,63.77 D1.A
  Top 0.61: 95.32,63.77 R1.1
N$6
  Top 1.016: J71.5 J71.4 J71.3 J71.2 J71.1 J37.5 J37.4 J37.3 J37.2 J37.1
N$7  (via drill 0.7)
  Top 0.305: 99.4,34.04 99.4,35.24 v99.73,35.56
  Top 0.406: ATMEGA328P.7 109.41,52.8 v108.62,53.59
  Bottom 0.305: v108.62,53.59 108.62,44.45 v99.73,35.56
N$8  (via drill 0.7)
  Top 0.305: ATMEGA328P.8 105.04,51.79 v104.81,51.56 | 97,34.04 97,35.88 v98.46,37.34
  Bottom 0.305: v104.81,51.56 104.81,43.69 v98.46,37.34
N$9
  Top 1.016: J3.1 J3.2 J3.3 J3.4 J3.5 J4.1 J4.2 J4.3 J4.4 J4.5
N$10  (via drill 0.7)
  other vias: 104.3,10.16
N$11
  Top 1.016: J10.5 J10.4 J10.3 J10.2 J10.1 J11.5 J11.4 J11.3 J11.2 J11.1
N$12
  Top 1.016: J76.5 J76.4 J76.3 J76.2 J76.1 J77.5 J77.4 J77.3 J77.2 J77.1
N$13
  Top 1.016: J67.1 J67.2 J67.3 J67.4 J67.5 J28.1 J28.2 J28.3 J28.4 J28.5
N$14
  Top 1.016: J41.1 J41.2 J41.3 J41.4 J41.5 J25.1 J25.2 J25.3 J25.4 J25.5
N$15
  Top 1.016: J79.1 J79.2 J79.3 J79.4 J79.5 J78.1 J78.2 J78.3 J78.4 J78.5
N$16
  Top 1.016: J82.1 J82.2 J82.3 J82.4 J82.5 J86.1 J86.2 J86.3 J86.4 J86.5
N$17
  Top 1.016: J46.1 J46.2 J46.3 J46.4 J46.5 J45.1 J45.2 J45.3 J45.4 J45.5
N$19
  Top 1.016: J47.5 J47.4 J47.3 J47.2 J47.1 J48.5 J48.4 J48.3 J48.2 J48.1
N$20
  Top 1.016: J12.1 J12.2 J12.3 J12.4 J12.5 J66.5 J66.4 J66.3 J66.2 J66.1
N$21
  Top 1.016: J61.1 J61.2 J61.3 J61.4 J61.5 J20.1 J20.2 J20.3 J20.4 J20.5
N$23
  Top 1.016: J38.5 J38.4 J38.3 J38.2 J38.1 J72.5 J72.4 J72.3 J72.2 J72.1
N$24
  Top 1.016: J24.1 J24.2 J24.3 J24.4 J24.5 J33.5 J33.4 J33.3 J33.2 J33.1
N$25
  Top 1.016: J23.1 J23.2 J23.3 J23.4 J23.5 J32.5 J32.4 J32.3 J32.2 J32.1
N$27
  Top 1.016: J53.5 J53.4 J53.3 J53.2 J53.1 J49.5 J49.4 J49.3 J49.2 J49.1
N$28
  Top 1.016: J59.5 J59.4 J59.3 J59.2 J59.1 J60.5 J60.4 J60.3 J60.2 J60.1
N$29
  Top 1.016: J14.5 J14.4 J14.3 J14.2 J14.1 J31.5 J31.4 J31.3 J31.2 J31.1
N$30
  Top 1.016: J30.1 J30.2 J30.3 J30.4 J30.5 J17.1 J17.2 J17.3 J17.4 J17.5
N$31
  Top 1.016: J52.1 J52.2 J52.3 J52.4 J52.5 J58.5 J58.4 J58.3 J58.2 J58.1
N$32
  Top 1.016: J50.5 J50.4 J50.3 J50.2 J50.1 J51.5 J51.4 J51.3 J51.2 J51.1
N$33
  Top 1.016: J29.1 J29.2 J29.3 J29.4 J29.5 J16.1 J16.2 J16.3 J16.4 J16.5
N$34
  Top 1.016: J43.1 J43.2 J43.3 J43.4 J43.5 J44.1 J44.2 J44.3 J44.4 J44.5
N$35
  Top 1.016: J15.5 J15.4 J15.3 J15.2 J15.1 J21.5 J21.4 J21.3 J21.2 J21.1
N$36
  Top 1.016: J42.5 J42.4 J42.3 J42.2 J42.1 J36.1 J36.2 J36.3 J36.4 J36.5
N$37
  Top 1.016: J13.5 J13.4 J13.3 J13.2 J13.1 J22.1 J22.2 J22.3 J22.4 J22.5
N$38
  Top 1.016: J6.5 J6.4 J6.3 J6.2 J6.1 J7.5 J7.4 J7.3 J7.2 J7.1
N$39
  Top 1.016: J9.1 J9.2 J9.3 J9.4 J9.5 J8.1 J8.2 J8.3 J8.4 J8.5
N$40
  Top 1.016: J34.5 J34.4 J34.3 J34.2 J34.1 J35.5 J35.4 J35.3 J35.2 J35.1
N$41
  Top 1.016: J40.1 J40.2 J40.3 J40.4 J40.5 J39.1 J39.2 J39.3 J39.4 J39.5
N$42
  Top 1.016: J5.5 J5.4 J5.3 J5.2 J5.1 J65.5 J65.4 J65.3 J65.2 J65.1
N$43
  Top 1.016: J63.5 J63.4 J63.3 J63.2 J63.1 J64.5 J64.4 J64.3 J64.2 J64.1
N$44
  Top 1.016: J57.1 J57.2 J57.3 J57.4 J57.5 J62.1 J62.2 J62.3 J62.4 J62.5
N$45
  Top 1.016: J55.1 J55.2 J55.3 J55.4 J55.5 J56.1 J56.2 J56.3 J56.4 J56.5
N$46
  Top 1.016: J19.5 J19.4 J19.3 J19.2 J19.1 J54.5 J54.4 J54.3 J54.2 J54.1
N$47
  Top 1.016: J80.1 J80.2 J80.3 J80.4 J80.5 J81.1 J81.2 J81.3 J81.4 J81.5
N$48
  Top 1.016: J26.1 J26.2 J26.3 J26.4 J26.5 J18.5 J18.4 J18.3 J18.2 J18.1
N$49
  Top 1.016: J70.5 J70.4 J70.3 J70.2 J70.1 J75.1 J75.2 J75.3 J75.4 J75.5
N$50
  Top 1.016: J2.1 J2.2 J2.3 J2.4 J2.5 J27.5 J27.4 J27.3 J27.2 J27.1
N$51
  Top 1.016: J69.5 J69.4 J69.3 J69.2 J69.1 J68.5 J68.4 J68.3 J68.2 J68.1
RESET
  Top 0.305: 104.55,15.62 R7.1 | 123.6,65.41 123.6,65.53
  Top 0.406: 104.55,15.62 104.55,18.8 118.78,33.02 POWER.6 133,33.02 133.51,33.53 133.51,64.9 132.87,65.53 129.45,65.53 125.38,61.47 123.73,61.47 123.6,61.34 | ATMEGA328P.29 121.21,47.9 123.6,50.29 123.6,61.34 | SPI.5 103.79,67.56 104.55,68.33 120.81,68.33 123.6,65.53 123.6,61.34 | UART2.1 102.27,13.34 104.42,15.49 R7.1
  Top 0.61: UART2.1 102.27,2.79 101.76,2.29 S1.3 S1.4 87.92,8.89 87.41,9.4 75.34,9.4 74.33,10.41 74.33,41.53 73.69,42.16 UART.1
RX-I  (via drill 0.6)
  Top 0.305: DIGITAL.1 89.31,63.5 96.17,56.64 121.57,56.64 122.84,55.37 122.84,50.42 121.19,48.77 115.77,48.77 ATMEGA328P.30
  Top 0.61: UART2.2 99.73,11.56 97.82,13.46 79.66,13.46 78.77,14.35 78.77,38.86 78.01,39.62 v77.12,39.62
  Bottom 0.61: v77.12,39.62 UART.2 70.77,39.62 70.01,40.39 70.01,62.23 71.28,63.5 DIGITAL.1
SCK  (via drill 0.7)
  Top 0.305: DIGITAL2.5 87.79,28.96 | 87.79,28.96 102.01,43.18 108.59,43.18 ATMEGA328P.17 | R6.2 87.79,28.96
  Top 0.61: v81.44,65.02 81.44,29.46 81.95,28.96 DIGITAL2.5
  Bottom 0.61: SPI.3 106.33,67.82 105.82,68.33 81.95,68.33 81.44,67.82 v81.44,65.02
SS  (via drill 0.6)
  Top 0.305: ATMEGA328P.14 94.97,46.3 85.25,36.58 DIGITAL2.8
  Top 0.61: PWM.5 79.41,51.05 80.17,50.29 v80.17,37.34
  Bottom 0.406: v80.17,37.34 80.17,37.08
  Bottom 0.61: 80.17,37.08 80.68,36.58 DIGITAL2.8
TX-O  (via drill 0.6, 0.7)
  Top 0.305: ATMEGA328P.31 121.03,49.5 122.08,50.55 122.08,55.12 121.06,56.13 95.92,56.13 91.09,60.96 DIGITAL.2
  Top 0.61: v79.66,62.23 79.66,62.99 v77.88,64.77 | UART2.3 97.19,10.29 95.16,12.32 78.39,12.32 77.25,13.46 77.25,36.45 v76.61,37.08
  Bottom 0.61: DIGITAL.2 82.71,60.96 81.44,62.23 v79.66,62.23 | v77.88,64.77 70.77,64.77 68.74,62.74 68.74,38.35 70.01,37.08 UART.3 v76.61,37.08
VIN  (via drill 0.7)
  Top 0.61: 118.1,1.02 118.16,1.07 118.2,1.07
  Top 0.813: U$1.2 107.92,5.65 107.6,5.97 106.85,5.97 106.47,5.59 106.47,1.64 107.09,1.02 118.1,1.02 | 118.2,1.07 119.29,2.16 119.29,10.67 120.81,12.19 125.84,12.19 J1.PWR
  Top 1.016: v124.11,28.45 127.79,28.45 129.06,27.18 129.06,12.19 128.3,11.43 126.65,11.43 J1.PWR
  Bottom 1.016: v124.11,28.45 124.11,40.01 129.83,45.72 POWER.1

### Text on the board
tPlace: LED1 | D0 | A5 | 1k | D1 | R1 | A4 | C1 | D2 | A3 | 0.1uF | D3 | A2 | D4 | A1 | D5 | A0 | D6 | PWM | D7 | VIN | RST | GND | D8 | GND | RX | D9 | 5V | TX | D10 | 3.3V | VCC | D11 | RST | GND | D12 | 1k | 5V | D13 | R6 | LED2 | GND | GND | AREF | C7 | VCC | 0.1uF | SDA | SDA | 47uF | SCL | SCL | R2 | R7 | 240 | 10k | 47uF | VCC | VCC | 715 | 0.1uF | R3 | C6 | V-REG | GND | GND | READY-UNO-SMD | GND | VCC | TX | RX | RST | Made In Morocco | V-REF | RESET | UART